# Altium schematic sheet INPUT SECTION.SchDoc
size A4; Organization: Altium Limited; Address1: L3, 12a Rodborough Rd; Address2: Frenchs Forest; Address3: NSW; Address4: Australia 2086
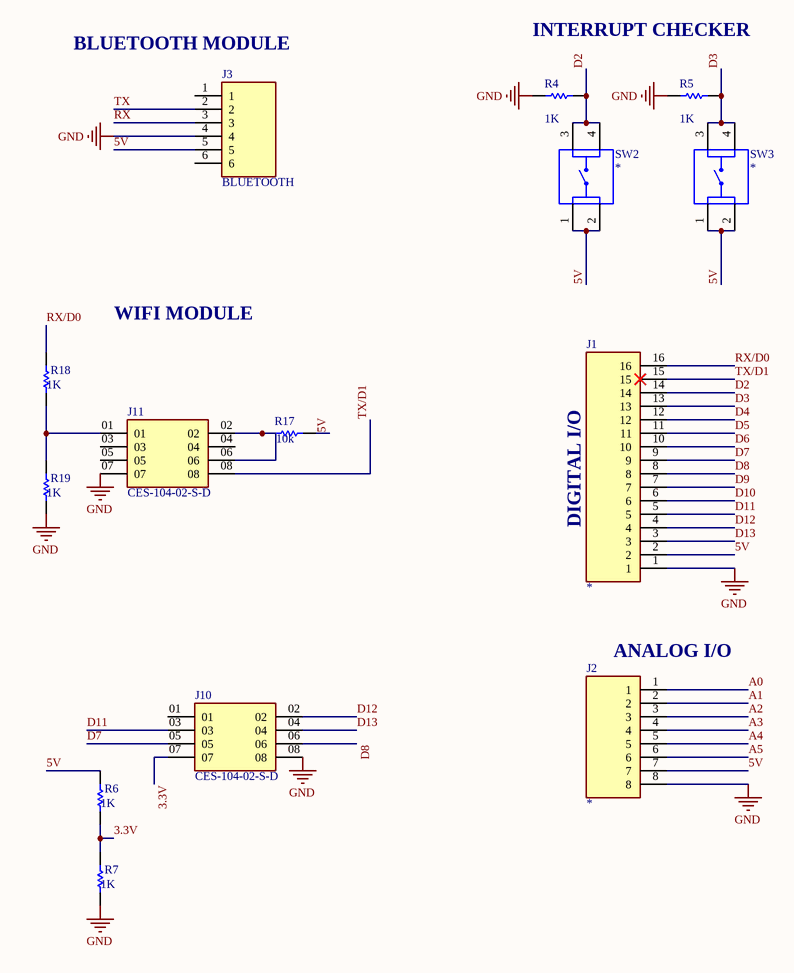
[diagram p0: INPUT SECTION.SchDoc]

## Parts
J1  1-215297-6  [TE_1-215297-6]  (value not drawn)
J2  5-534237-6  [TE_5-534237-6]  (value not drawn)
J3  BLUETOOTH  [HDRV6W70P0X254_1X6_1564X250X865P]
J10  CES-104-02-S-D  [SAMTEC_CES-104-02-S-D]
J11  CES-104-02-S-D  [SAMTEC_CES-104-02-S-D]
R4  value 1K  [AXIAL-0.5]
R5  value 1K  [AXIAL-0.5]
R6  value 1K  [AXIAL-0.5]
R7  value 1K  [AXIAL-0.5]
R17  value 10k  [AXIAL-0.5]
R18  value 1K  [AXIAL-0.5]
R19  value 1K  [AXIAL-0.5]
SW2  1825910-6  [SW_1825910-6-4]  (value not drawn)
SW3  1825910-6  [SW_1825910-6-4]  (value not drawn)

## Nets
GND: J1.1 J2.8 J3.4 J10.08 J11.07 R4.2 R5.2 R7.1 R19.1
3.3V: J10.07 R6.1 R7.2
5V: J1.2 J2.7 J3.5 R6.2 R17.1 SW2.1 SW2.2 SW3.1 SW3.2
A0: J2.1
A1: J2.2
A2: J2.3
A3: J2.4
A4: J2.5
A5: J2.6
D2: J1.14 R4.1 SW2.3 SW2.4
D3: J1.13 R5.1 SW3.3 SW3.4
D4: J1.12
D5: J1.11
D6: J1.10
D7: J1.9 J10.05
D8: J1.8 J10.06
D9: J1.7
D10: J1.6
D11: J1.5 J10.03
D12: J1.4 J10.02
D13: J1.3 J10.04
RX: J3.3
RX/D0: J1.16 R18.2
TX: J3.2
TX/D1: J1.15 J11.08
NetJ11_01: J11.01 R18.1 R19.2
NetJ11_02: J11.02 J11.06 R17.2

Not connected (* = marked no-connect by the designer): J3 1 6; J10 01; J11 03 04 05

## Notes on the sheet
- (near J3) BLUETOOTH MODULE
- INTERRUPT CHECKER
- WIFI MODULE
- DIGITAL I/O
- (near J2) ANALOG I/O
- Title
- Size:
- Date:
- A4
- Number:
- Time:
- Revision:
- Sheet
- of
- File:

## Library data of the parts
J1 = 1-215297-6: Ú©Ø§Ø±ØªÙ† Ø§ØªØµØ§Ù„ Ø³ÙˆÚ©Øª Ù†ÙˆØ§Ø± SKT 16 POS 2.54 Ù…ÛŒÙ„ÛŒ Ù…ØªØ± Ù„Ø­ÛŒÙ… Ú©Ø§Ø±ÛŒ ST Thru-Hole; Number_of_Positions: 16; Centerline_Pitch: 2.54 mm[.1 in]; Product_Type: Connector; MF: TE Connectivity; Purchase-URL: https://pricing.snapeda.com/search/part/1-215297-6/?ref=eda; Package: None; MP: 1-215297-6; Value: *; Price: None; Availability: Good; SnapEDA_Link: https://www.snapeda.com/parts/1-215297-6/TE%20Connectivity%20AMP%20Connectors/view-part/449123/?ref=snap; EU_RoHS_Compliance: Compliant; Check_prices: https://www.snapeda.com/parts/1-215297-6/TE%20Connectivity%20AMP%20Connectors/view-part/449123/?ref=eda; Comment_1: *
J2 = 5-534237-6: Connector Socket Strip Receptacle 8 Position 2.54mm Solder Straight Through Hole; Number_of_Positions: 8; MF: TE Connectivity; Centerline_Pitch: 2.54; Price: None; Value: *; Package: None; Mouser-Purchase-URL: https://snapeda.com/shop?store=Mouser&id=468085; Arrow_Electronics-Purchase-URL: https://snapeda.com/shop?store=Arrow+Electronics&id=468085; SnapEDA_Link: https://www.snapeda.com/parts/5-534237-6/TE%20Connectivity%20AMP%20Connectors/view-part/468085/?ref=snap; EU_RoHS_Compliance: Compliant; Availability: Good; Product_Type: Connector; DigiKey-Purchase-URL: https://snapeda.com/shop?store=DigiKey&id=468085; MP: 5-534237-6; Comment_1: *
J3 = M20-7820646: Connector; Manufacturer_Name: Harwin; Datasheet Link: https://cdn.harwin.com/pdfs/M20-782.pdf; Height: 8.65mm; Manufacturer_Part_Number: M20-7820646; Mouser Part Number: 855-M20-7820646; Mouser Price/Stock: https://www.mouser.co.uk/ProductDetail/Harwin/M20-7820646?qs=WS5Jv%252B%252Bx1qWZs4rbTjPGWw%3D%3D
J10 J11 = CES-104-02-S-D: 8 Position Receptacle Connector Through Hole; MF: Samtec; DigiKey-Purchase-URL: https://snapeda.com/shop?store=DigiKey&id=3430619; Package: None; Value: *; Availability: Unavailable; MP: CES-104-02-S-D; SnapEDA_Link: https://www.snapeda.com/parts/CES-104-02-S-D/Samtec/view-part/3430619/?ref=snap; Price: None
R4-R7 R17-R19 = Res Semi: Semiconductor Resistor; Published: 8-Jun-2000; LatestRevisionDate: 17-Jul-2002; LatestRevisionNote: Re-released for DXP Platform.; PackageReference: AXIAL-0.5; Publisher: Altium Limited; PackageDescription: Axial Device, Thru-Hole; 2 Leads; 0.5 in Pin Spacing
SW2 SW3 = 1825910-6: Switch Push Button OFF _ON_ SPST Round Button 0.05A 24VDC Momentary Contact PC Pins Thru-Hole; Configuration_Pole-Throw: Single Pole - Single Throw; MF: TE Connectivity; Contact_Current_Rating: 50 mA; Digi-Key_Purchase_URL: https://www.digikey.com/product-detail/en/te-connectivity-alcoswitch-switches/1825910-6/450-1650-ND/1632536?utm_source=snapeda&utm_medium=aggregator&utm_campaign=symbol; TE_purchase_URL: https://www.te.com/usa-en/product-1825910-6.html?te_bu=Cor&te_type=disp&te_campaign=seda_glo_cor-seda-global-disp-prtnr-fy19-seda-model-bom-cta_sma-317_1&elqCampaignId=32493; Value: *; Digi-Key_Part_Number: 450-1650-ND; SnapEDA_Link: https://www.snapeda.com/parts/1825910-6/TE%20Connectivity%20ALCOSWITCH%20Switches/view-part/424522/?ref=snap; EU_RoHS_Compliance: Compliant; MP: 1825910-6; Package: None; Comment_1: *